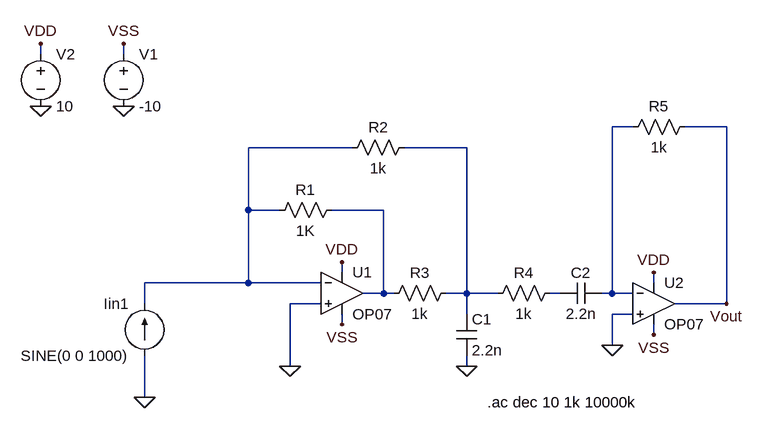
[diagram p0: schematic Draft1.asc]
Draft1.asc, the LTspice schematic file:
Version 4
SHEET 1 968 680
WIRE -128 96 -128 80
WIRE 0 96 0 80
WIRE 784 208 752 208
WIRE 928 208 864 208
WIRE 352 240 192 240
WIRE 528 240 432 240
WIRE 192 336 192 240
WIRE 240 336 192 336
WIRE 400 336 320 336
WIRE 336 432 336 416
WIRE 192 448 192 336
WIRE 192 448 32 448
WIRE 304 448 192 448
WIRE 816 448 816 432
WIRE 400 464 400 336
WIRE 400 464 368 464
WIRE 416 464 400 464
WIRE 528 464 528 240
WIRE 528 464 496 464
WIRE 576 464 528 464
WIRE 672 464 656 464
WIRE 752 464 752 208
WIRE 752 464 736 464
WIRE 784 464 752 464
WIRE 32 480 32 448
WIRE 304 480 256 480
WIRE 928 480 928 208
WIRE 928 480 848 480
WIRE 528 496 528 464
WIRE 784 496 752 496
WIRE 336 512 336 496
WIRE 816 528 816 512
WIRE 752 544 752 496
WIRE 256 576 256 480
WIRE 528 576 528 560
WIRE 32 624 32 560
FLAG 0 176 0
FLAG -128 176 0
FLAG -128 80 VDD
FLAG 0 80 VSS
FLAG 336 416 VDD
FLAG 336 512 VSS
FLAG 32 624 0
FLAG 256 576 0
FLAG 528 576 0
FLAG 816 432 VDD
FLAG 816 528 VSS
FLAG 752 544 0
FLAG 928 480 Vout
SYMBOL OP07 336 400 R0
SYMATTR InstName U1
SYMBOL voltage 0 80 R0
SYMATTR InstName V1
SYMATTR Value -10
SYMBOL voltage -128 80 R0
SYMATTR InstName V2
SYMATTR Value 10
SYMBOL current 32 560 R180
WINDOW 0 24 80 Left 2
WINDOW 3 24 0 Left 2
SYMATTR InstName Iin1
SYMATTR Value SINE(0 0 1000)
SYMATTR Value2 AC 10 m
SYMBOL Res 336 320 R90
WINDOW 0 0 56 VBottom 2
WINDOW 3 32 56 VTop 2
SYMATTR InstName R1
SYMATTR Value 1K
SYMBOL Res 448 224 R90
WINDOW 0 0 56 VBottom 2
WINDOW 3 32 56 VTop 2
SYMATTR InstName R2
SYMATTR Value 1k
SYMBOL Res 512 448 R90
WINDOW 0 0 56 VBottom 2
WINDOW 3 32 56 VTop 2
SYMATTR InstName R3
SYMATTR Value 1k
SYMBOL Cap 512 496 R0
SYMATTR InstName C1
SYMATTR Value 2.2n
SYMBOL Res 672 448 R90
WINDOW 0 0 56 VBottom 2
WINDOW 3 32 56 VTop 2
SYMATTR InstName R4
SYMATTR Value 1k
SYMBOL Cap 736 448 R90
WINDOW 0 0 32 VBottom 2
WINDOW 3 32 32 VTop 2
SYMATTR InstName C2
SYMATTR Value 2.2n
SYMBOL OP07 816 416 R0
SYMATTR InstName U2
SYMBOL Res 880 192 R90
WINDOW 0 0 56 VBottom 2
WINDOW 3 32 56 VTop 2
SYMATTR InstName R5
SYMATTR Value 1k
TEXT 560 632 Left 2 !.ac dec 10 1k 10000k

The netlist it stands for:
* Draft1.asc
XU1 0 N002 VDD VSS N004 LT1001  ; OP07, pins In+ In- V+ V- OUT
V1 VSS 0 -10
V2 VDD 0 10
Iin1 0 N002 SINE(0 0 1000) AC 10 m
R1 N004 N002 1K
R2 N003 N002 1k
R3 N003 N004 1k
C1 N003 0 2.2n
R4 N005 N003 1k
C2 N001 N005 2.2n
XU2 0 N001 VDD VSS Vout LT1001  ; OP07, pins In+ In- V+ V- OUT
R5 Vout N001 1k
.ac dec 10 1k 10000k
.lib LTC.lib
.backanno
.end